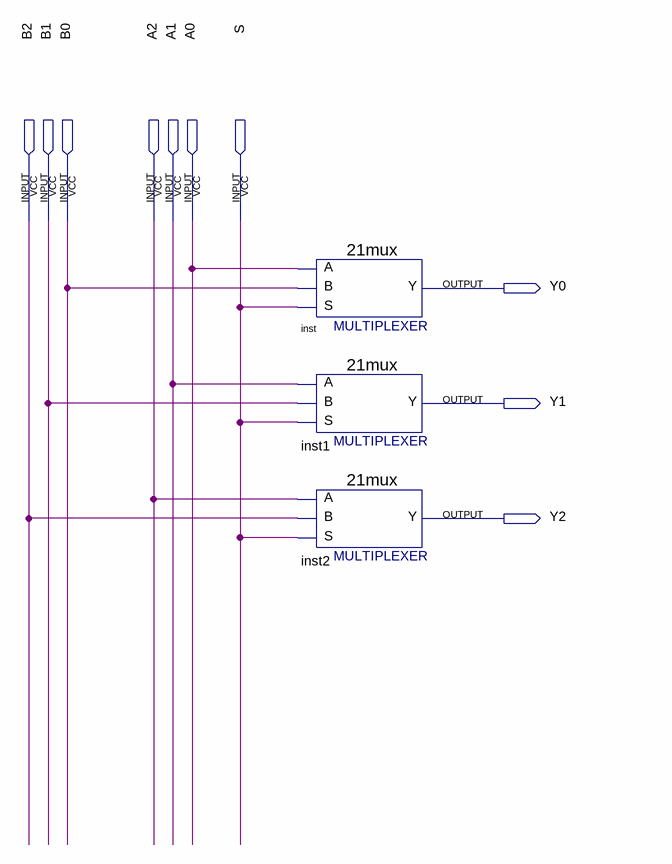
[diagram p0: schematic sheet]
// Quartus schematic mux3.bdf as structural Verilog: 3 symbols, 10 pins
module mux3 (
  input  B2,
  input  B1,
  input  B0,
  input  A2,
  input  A1,
  input  A0,
  input  S,
  output Y0,
  output Y1,
  output Y2
);

  \21mux  inst (.S(S), .B(B0), .A(A0), .Y(Y0));
  \21mux  inst1 (.S(S), .B(B1), .A(A1), .Y(Y1));
  \21mux  inst2 (.S(S), .B(B2), .A(A2), .Y(Y2));
endmodule
